# Altium schematic sheet CardEdge1_Mother.SchDoc
size B; SheetNumber: 1; SheetTotal: 1
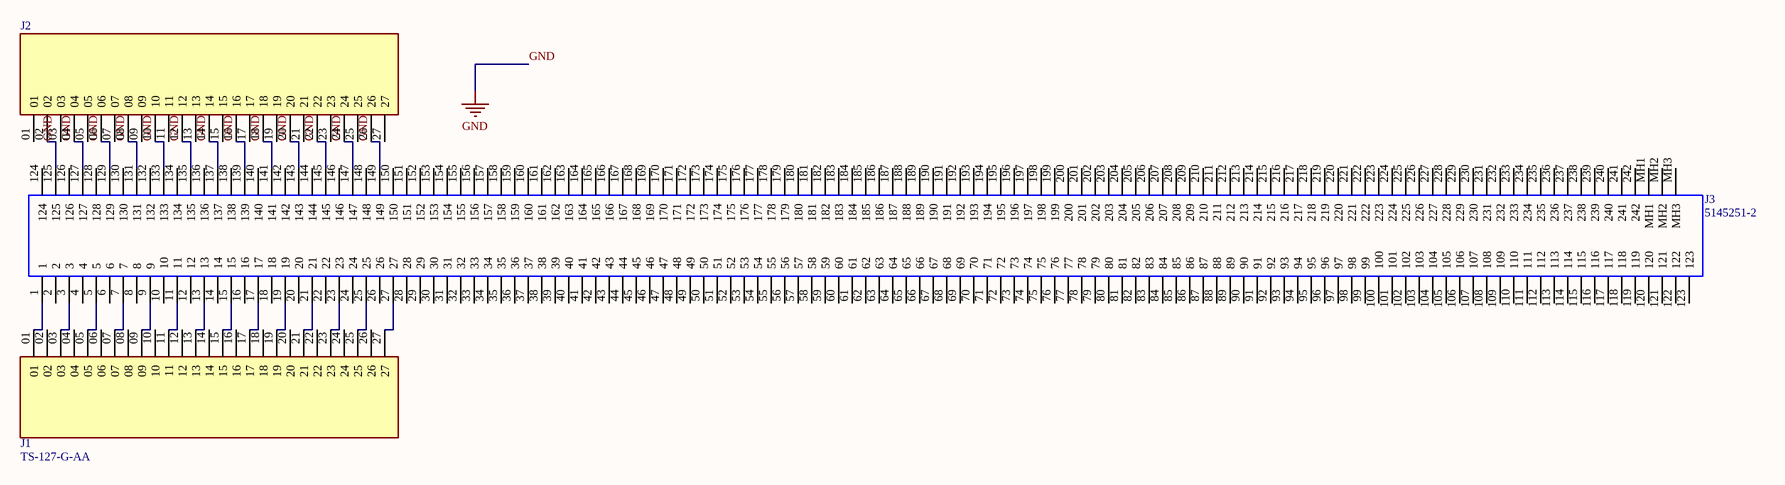
[diagram p0: CardEdge1_Mother.SchDoc]

## Parts
J1  TS-127-G-AA  [SAMTEC_TS-127-G-AA]
J2  TS-127-G-AA  [SAMTEC_TS-127-G-AA]  (value not drawn)
J3  5145251-2  [51452512]

## Nets
GND: J2.02 J2.04 J2.06 J2.08 J2.10 J2.12 J2.14 J2.16 J2.18 J2.20 J2.22 J2.24 J2.26 J3.125 J3.127 J3.129 J3.131 J3.133 J3.135 J3.137 J3.139 J3.141 J3.143 J3.145 J3.147 J3.149
NetJ1_01: J1.01 J3.1
NetJ1_03: J1.03 J3.3
NetJ1_05: J1.05 J3.5
NetJ1_07: J1.07 J3.7
NetJ1_09: J1.09 J3.9
NetJ1_11: J1.11 J3.11
NetJ1_13: J1.13 J3.13
NetJ1_15: J1.15 J3.15
NetJ1_17: J1.17 J3.17
NetJ1_19: J1.19 J3.19
NetJ1_21: J1.21 J3.21
NetJ1_23: J1.23 J3.23
NetJ1_25: J1.25 J3.25
NetJ1_27: J1.27 J3.27

Not connected (* = marked no-connect by the designer): J1 02 04 06 08 10 12 14 16 18 20 22 24 26; J2 01 03 05 07 09 11 13 15 17 19 21 23 25 27; J3 2 4 6 8 10 12 14 16 18 20 22 24 26 28 29 30 31 32 33 34 35 36 37 38 39 40 41 42 43 44 45 46 47 48 49 50 51 52 53 54 55 56 57 58 59 60 61 62 63 64 65 66 67 68 69 70 71 72 73 74 75 76 77 78 79 80 81 82 83 84 85 86 87 88 89 90 91 92 93 94 95 96 97 98 99 100 101 102 103 104 105 106 107 108 109 110 111 112 113 114 115 116 117 118 119 120 121 122 123 124 126 128 130 132 134 136 138 140 142 144 146 148 150 151 152 153 154 155 156 157 158 159 160 161 162 163 164 165 166 167 168 169 170 171 172 173 174 175 176 177 178 179 180 181 182 183 184 185 186 187 188 189 190 191 192 193 194 195 196 197 198 199 200 201 202 203 204 205 206 207 208 209 210 211 212 213 214 215 216 217 218 219 220 221 222 223 224 225 226 227 228 229 230 231 232 233 234 235 236 237 238 239 240 241 242 MH1 MH2 MH3

## Library data of the parts
J1 J2 = CMP-029-000000-1: Connector Header position; MF: Samtec; Price: None; Source: TS-127-G-AA.SchLib; Purchase-URL: https://pricing.snapeda.com/search/part/TS-127-G-AA/?ref=eda; MP: TS-127-G-AA; Pin Count: 27; Check_prices: https://www.snapeda.com/parts/TS-127-G-AA/Samtec/view-part/?ref=eda; Value: *; Design Item ID: TS-127-G-AA; Package: None; Availability: In Stock; SnapEDA_Link: https://www.snapeda.com/parts/TS-127-G-AA/Samtec/view-part/?ref=snap; Component Type: Standard
J3 = 5145251-2: AMP 1MM STD EDGE 242 POS; Manufacturer_Name: TE Connectivity; Geometry.Height: 15.7mm; Manufacturer_Part_Number: 5145251-2; Mouser Part Number: *; Mouser Price/Stock: *; Arrow Part Number: *; Arrow Price/Stock: *; Mouser Testing Part Number: *; Mouser Testing Price/Stock: *; Datasheet Link: https://www.te.com/commerce/DocumentDelivery/DDEController?Action=srchrtrv&DocNm=5145251&DocType=Customer+Drawing&DocLang=English